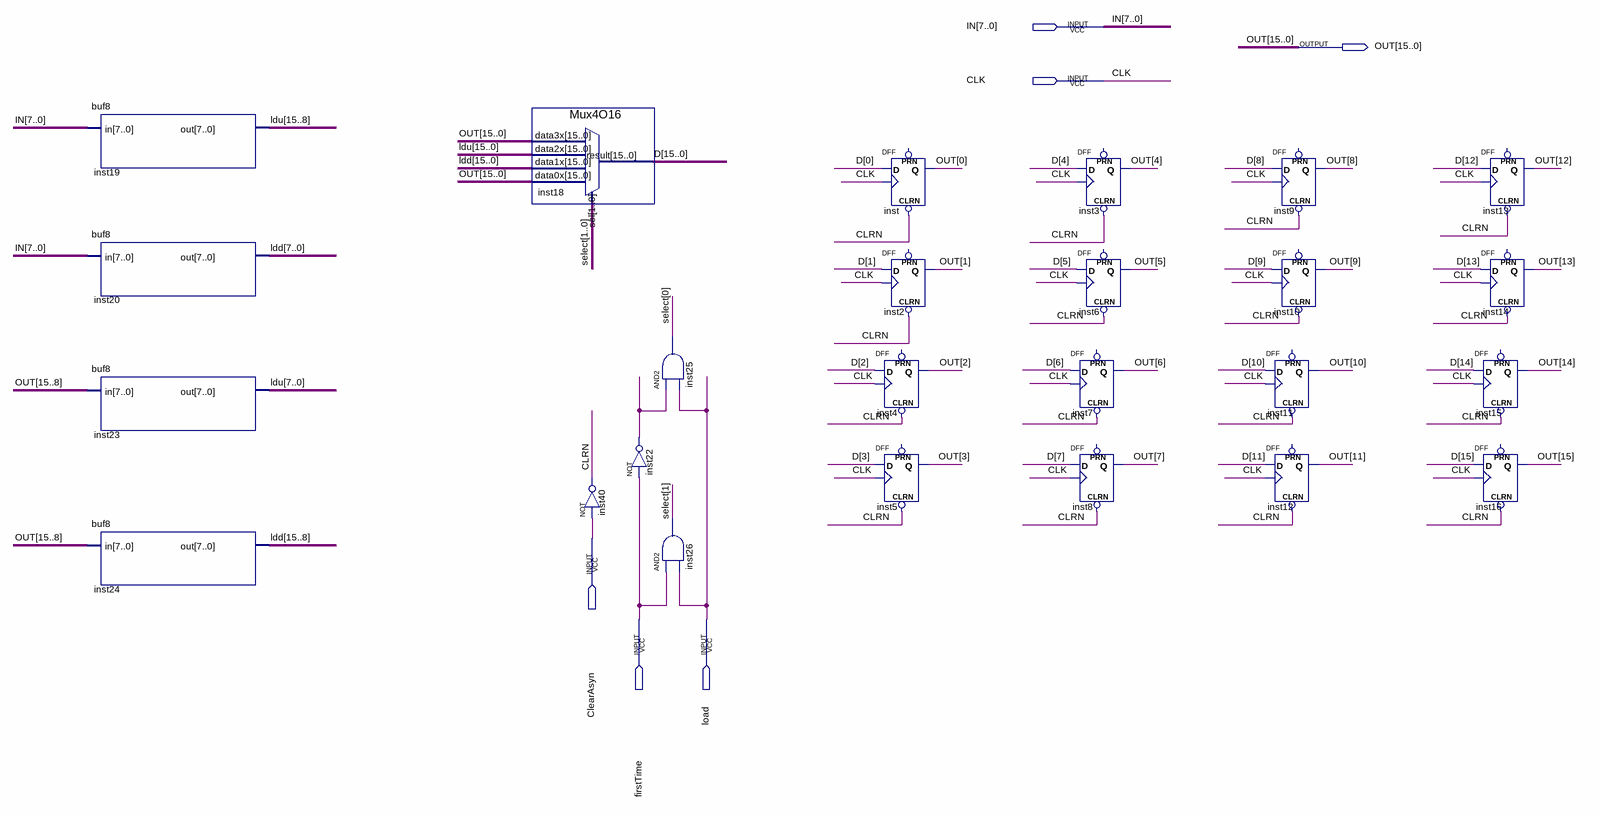
[diagram p0: schematic sheet]
// Quartus schematic Register16.bdf as structural Verilog: 25 symbols, 6 pins
module Register16 (
  input  [7:0] IN,
  input  CLK,
  input  ClearAsyn,
  input  firstTime,
  input  load,
  output [15:0] OUT
);

  wire CLRN, inst22_out;
  wire [1:0] select;
  wire [15:0] D, ldd, ldu;

  buf8 inst19 (.in(IN), .out(ldu[15:8]));
  buf8 inst20 (.in(IN), .out(ldd[7:0]));
  buf8 inst23 (.in(OUT[15:8]), .out(ldu[7:0]));
  buf8 inst24 (.in(OUT[15:8]), .out(ldd[15:8]));
  Mux4O16 inst18 (.data3x(OUT), .data2x(ldu), .data1x(ldd), .data0x(OUT), .sel(select), .result(D));
  not inst40 (CLRN, ClearAsyn);
  and inst25 (select[0], inst22_out, load);
  not inst22 (inst22_out, firstTime);
  and inst26 (select[1], firstTime, load);
  DFF inst (.CLRN(CLRN), .CLK(CLK), .D(D[0]), .Q(OUT[0]));  // open: PRN
  DFF inst2 (.CLRN(CLRN), .CLK(CLK), .D(D[1]), .Q(OUT[1]));  // open: PRN
  DFF inst4 (.CLRN(CLRN), .CLK(CLK), .D(D[2]), .Q(OUT[2]));  // open: PRN
  DFF inst5 (.CLRN(CLRN), .CLK(CLK), .D(D[3]), .Q(OUT[3]));  // open: PRN
  DFF inst3 (.CLRN(CLRN), .CLK(CLK), .D(D[4]), .Q(OUT[4]));  // open: PRN
  DFF inst6 (.CLRN(CLRN), .CLK(CLK), .D(D[5]), .Q(OUT[5]));  // open: PRN
  DFF inst7 (.CLRN(CLRN), .CLK(CLK), .D(D[6]), .Q(OUT[6]));  // open: PRN
  DFF inst8 (.CLRN(CLRN), .CLK(CLK), .D(D[7]), .Q(OUT[7]));  // open: PRN
  DFF inst11 (.CLRN(CLRN), .CLK(CLK), .D(D[10]), .Q(OUT[10]));  // open: PRN
  DFF inst12 (.CLRN(CLRN), .CLK(CLK), .D(D[11]), .Q(OUT[11]));  // open: PRN
  DFF inst9 (.CLRN(CLRN), .CLK(CLK), .D(D[8]), .Q(OUT[8]));  // open: PRN
  DFF inst10 (.CLRN(CLRN), .CLK(CLK), .D(D[9]), .Q(OUT[9]));  // open: PRN
  DFF inst13 (.CLRN(CLRN), .CLK(CLK), .D(D[12]), .Q(OUT[12]));  // open: PRN
  DFF inst14 (.CLRN(CLRN), .CLK(CLK), .D(D[13]), .Q(OUT[13]));  // open: PRN
  DFF inst15 (.CLRN(CLRN), .CLK(CLK), .D(D[14]), .Q(OUT[14]));  // open: PRN
  DFF inst16 (.CLRN(CLRN), .CLK(CLK), .D(D[15]), .Q(OUT[15]));  // open: PRN
endmodule
